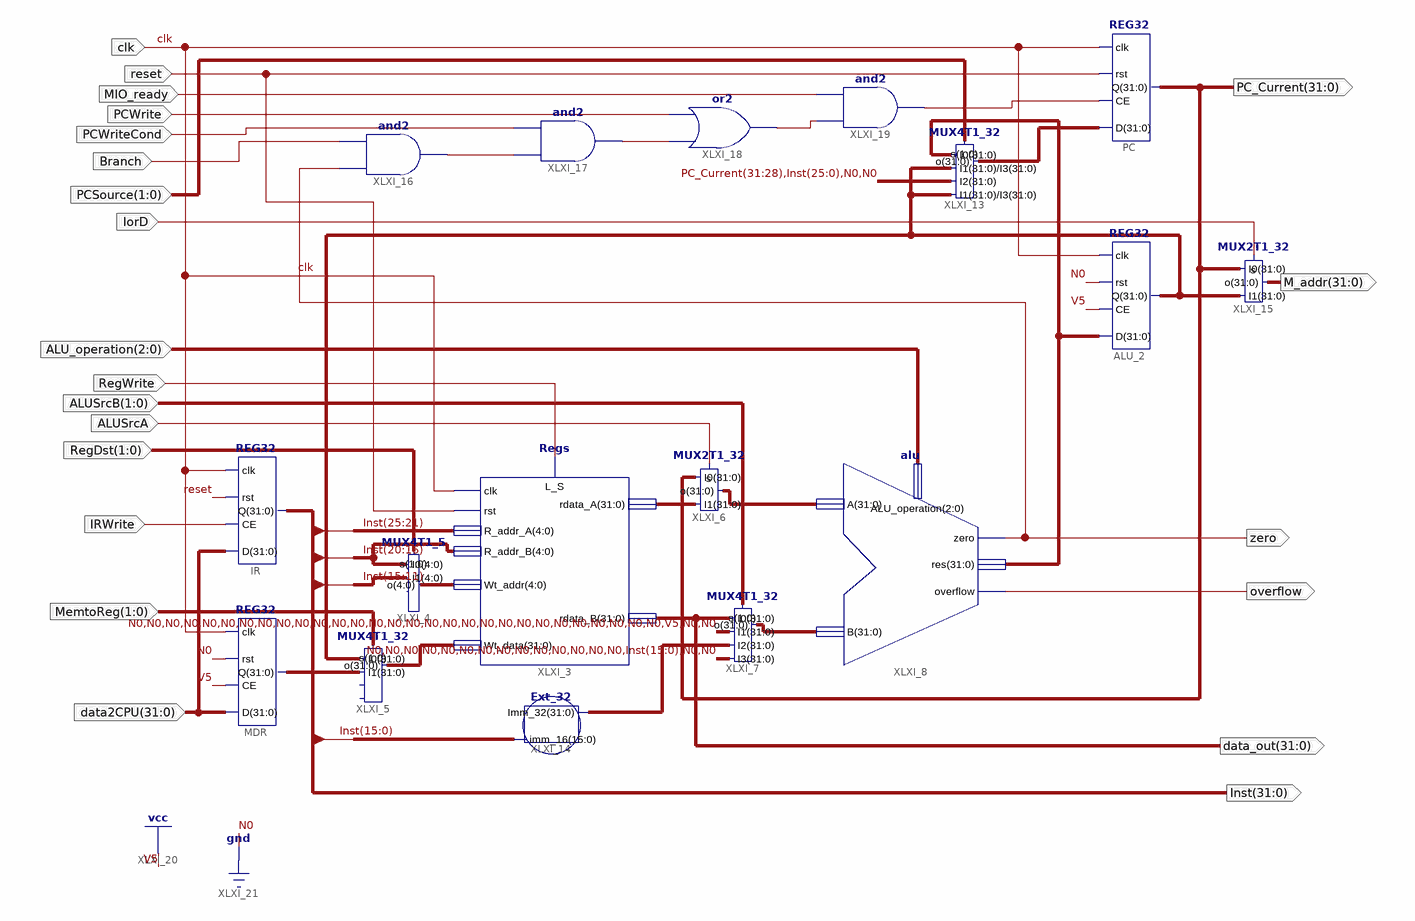
[diagram p0: schematic sheet 1]
// Xilinx ISE schematic M_datapath.sch (kintex7) as structural Verilog: 17 symbols, 22 ports
module M_datapath (
  input  [31:0] data2CPU,
  input  IRWrite,
  input  reset,
  input  clk,
  input  [1:0] ALUSrcB,
  input  ALUSrcA,
  input  IorD,
  input  [1:0] RegDst,
  input  [1:0] MemtoReg,
  input  MIO_ready,
  input  Branch,
  input  [1:0] PCSource,
  input  [2:0] ALU_operation,
  input  RegWrite,
  input  PCWrite,
  input  PCWriteCond,
  output overflow,
  output zero,
  output [31:0] Inst,
  output [31:0] data_out,
  output [31:0] PC_Current,
  output [31:0] M_addr
);

  wire XLXN_64, XLXN_65, XLXN_66, XLXN_67;
  wire [4:0] XLXN_52;
  wire [31:0] ALU_Out, XLXN_16, XLXN_17, XLXN_23, XLXN_36, XLXN_37, XLXN_44, XLXN_45, XLXN_73;

  Regs XLXI_3 (
    .clk(clk), .L_S(RegWrite), .rdata_A(XLXN_45), .rst(reset), .Wt_data(XLXN_17), .rdata_B(data_out),
    .R_addr_A(Inst[25:21]), .R_addr_B(Inst[20:16]), .Wt_addr(XLXN_52));
  MUX4T1_5 XLXI_4 (.s(RegDst), .I1(Inst[15:11]), .I0(Inst[20:16]), .o(XLXN_52));  // open: I2, I3
  MUX4T1_32 XLXI_5 (.s(MemtoReg), .I0(ALU_Out), .I1(XLXN_16), .o(XLXN_17));  // open: I2, I3
  MUX2T1_32 XLXI_6 (.s(ALUSrcA), .I0(PC_Current), .I1(XLXN_45), .o(XLXN_44));
  MUX4T1_32 XLXI_7 (
    .s(ALUSrcB), .I0(data_out), .I1(32'b00000000000000000000000000000100), .I2(XLXN_36),
    .I3({{14{1'b0}}, Inst[15:0], 2'b00}), .o(XLXN_37));
  alu XLXI_8 (.zero(zero), .res(XLXN_73), .overflow(overflow), .A(XLXN_44), .B(XLXN_37), .ALU_operation(ALU_operation));
  REG32 ALU_2 (.D(XLXN_73), .CE(1'b1), .rst(1'b0), .clk(clk), .Q(ALU_Out));
  REG32 PC (.D(XLXN_23), .CE(XLXN_67), .rst(reset), .clk(clk), .Q(PC_Current));
  REG32 IR (.D(data2CPU), .CE(IRWrite), .rst(reset), .clk(clk), .Q(Inst));
  REG32 MDR (.D(data2CPU), .CE(1'b1), .rst(1'b0), .clk(clk), .Q(XLXN_16));
  MUX4T1_32 XLXI_13 (
    .s(PCSource), .I0(XLXN_73), .I1(ALU_Out), .I2({PC_Current[31:28], Inst[25:0], 2'b00}), .I3(ALU_Out),
    .o(XLXN_23));
  Ext_32 XLXI_14 (.imm_16(Inst[15:0]), .Imm_32(XLXN_36));
  MUX2T1_32 XLXI_15 (.s(IorD), .I0(PC_Current), .I1(ALU_Out), .o(M_addr));
  and XLXI_16 (XLXN_64, zero, Branch);
  and XLXI_17 (XLXN_65, XLXN_64, PCWriteCond);
  or XLXI_18 (XLXN_66, XLXN_65, PCWrite);
  and XLXI_19 (XLXN_67, XLXN_66, MIO_ready);
endmodule
